# Altium schematic sheet OPAMPSupply.SchDoc
size A
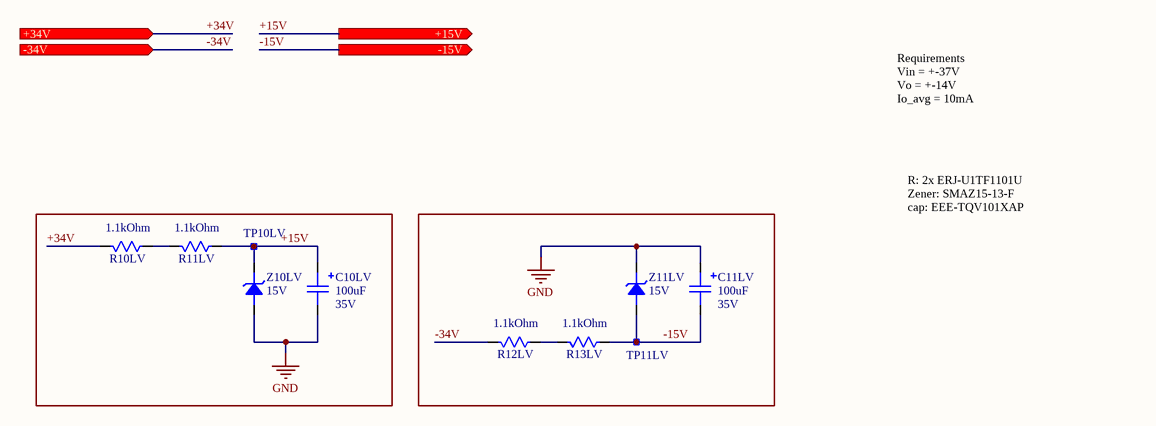
[diagram p0: OPAMPSupply.SchDoc]

## Parts
C10LV  Capacitance: 100uF  Voltage Rating: 35V  [CAPAE7866X80M-PANASONIC-TQ-A]  (hidden comment: EEE-TQV101XAP)
C11LV  Capacitance: 100uF  Voltage Rating: 35V  [CAPAE7866X80M-PANASONIC-TQ-A]  (hidden comment: EEE-TQV101XAP)
R10LV  Resistance: 1.1kOhm  [Chip2PinSM127P600-8N-PANASONIC-ERJU1T]  (hidden comment: ERJ-U1TF1101U)
R11LV  Resistance: 1.1kOhm  [Chip2PinSM127P600-8N-PANASONIC-ERJU1T]  (hidden comment: ERJ-U1TF1101U)
R12LV  Resistance: 1.1kOhm  [Chip2PinSM127P600-8N-PANASONIC-ERJU1T]  (hidden comment: ERJ-U1TF1101U)
R13LV  Resistance: 1.1kOhm  [Chip2PinSM127P600-8N-PANASONIC-ERJU1T]  (hidden comment: ERJ-U1TF1101U)
TP10LV  TP_0.75mm  [Pad_0.75mm]  (value not drawn)  (no BOM)
TP11LV  TP_0.75mm  [Pad_0.75mm]  (value not drawn)  (no BOM)
Z10LV  Zener Voltage: 15V  [DIODESINC-SMA]  (hidden comment: SMAZ15-13-F)
Z11LV  Zener Voltage: 15V  [DIODESINC-SMA]  (hidden comment: SMAZ15-13-F)

## Ports
+15V (out), +34V (in), -15V (out), -34V (in)

## Nets
GND: C10LV.2 C11LV.1 Z10LV.A Z11LV.K
+15V: C10LV.1 R11LV.2 TP10LV.?1 Z10LV.K ; port +15V
+34V: R10LV.1 ; port +34V
-15V: C11LV.2 R13LV.2 TP11LV.?1 Z11LV.A ; port -15V
-34V: R12LV.1 ; port -34V
NetR10LV_2: R10LV.2 R11LV.1
NetR12LV_2: R12LV.2 R13LV.1

## Notes on the sheet
- Requirements
  Vin = +-37V
  Vo = +-14V
  Io_avg = 10mA
- R: 2x ERJ-U1TF1101U
  Zener: SMAZ15-13-F
  cap: EEE-TQV101XAP

## Library data of the parts
C10LV C11LV = EEE-TQV101XAP: Cap Aluminum 100uF 35V 20% (6.3 X 7.7mm) SMD 0.0003 Ohm 197mA 2000 hr 125°C T/R; Manufacturer: Panasonic; ESR (Equivalent Series Resistance): 300mR; Life (Hours): 2000Hour; Lead Diameter: 0.65mm; Supplier 1: RSComponents; Manufacturer Part Number: EEE-TQV101XAP; RoHS: Yes; Category: Aluminum Electrolytic Capacitors; Stock 1: 10800; Pricing 1: 5=1.00000, 50=0.75600, 250=0.54600, 500=0.36400, 900=0.35000 (EUR); Mount: Surface Mount; Case/Package: Radial; Number of Pins: 8; Min Operating Temperature: -40°C; Max Operating Temperature: 125°C; Tolerance: 20%; Packaging: Tape and Reel; Package Quantity: 900; Ripple Current: 197mA; Voltage Rating (DC): 35V; Termination: SMD/SMT; Series: TQ; Ripple Current (AC): 197mA; Voltage: 35V; Construction: Cylindrical; Diameter: 6.3mm; Length: 7.7mm; Height: 7.7mm; Height - Seated (Max): 0.315inch; Lead Pitch: 1.8mm; RoHS Compliant: Yes; REACH SVHC: No SVHC; Lead Free: Lead Free; ComponentLink1URL: https://datasheet.ciiva.com/23859/aba0000ce139-23859013.pdf?src-supplier=Newark; ComponentLink1Description: https://datasheet.ciiva.com/23859/aba0000ce139-23859013.pdf?src-supplier=Newark; ComponentLink2URL: https://datasheet.ciiva.com/30502/0900766b81183640-30502676.pdf?src-supplier=RSComponents; ComponentLink2Description: https://datasheet.ciiva.com/30502/0900766b81183640-30502676.pdf?src-supplier=RSComponents; ComponentLink3URL: https://datasheet.ciiva.com/30198/aba0000ce139-30198276.pdf?src-supplier=Onlinecomponents.com; ComponentLink3Description: https://datasheet.ciiva.com/30198/aba0000ce139-30198276.pdf?src-supplier=Onlinecomponents.com; ComponentLink4URL: https://datasheet.ciiva.com/14497/1679509-14497981.pdf?src-supplier=Farnell; ComponentLink4Description: https://datasheet.ciiva.com/14497/1679509-14497981.pdf?src-supplier=Farnell; ComponentLink5URL: https://datasheet.ciiva.com/22683/1679509-22683999.pdf?src-supplier=Element14; ComponentLink5Description: https://datasheet.ciiva.com/22683/1679509-22683999.pdf?src-supplier=Element14; ComponentLink6URL: https://datasheet.ciiva.com/15934/aba0000ce139-15934059.pdf?src-supplier=Onlinecomponents.com; ComponentLink6Description: https://datasheet.ciiva.com/15934/aba0000ce139-15934059.pdf?src-supplier=Onlinecomponents.com
R10LV R11LV R12LV R13LV = ERJ-U1TF1101U: Power: 1W; Size: 2512
TP10LV TP11LV = TP_0.75mm: Pad testpoint with 0.75mm Diameter
Z10LV Z11LV = SMAZ15-13-F: Vz=15V 14.25V~15.75V Izt=50mA P=1W; Manufacturer: Diodes; Max Reverse Leakage Current: 1uA; Element Configuration: Single; Tolerance: 5%; Forward Voltage: 1.2V; Max Power Dissipation: 1W; Impedance: 10R; Test Current: 50mA; Supplier 1: Farnell; Manufacturer Part Number: SMAZ15-13-F; RoHS: Yes; Category: Zener Diodes; Stock 1: 7565; Pricing 1: 5=0.47100, 50=0.29300, 250=0.20100, 1000=0.15400 (EUR); Mount: Surface Mount; Case/Package: SMA; Number of Pins: 2; Weight: 0.002258oz; Min Operating Temperature: -65°C; Max Operating Temperature: 150°C; Packaging: Tape and Reel; Package Quantity: 5000; Voltage Tolerance: 5%; Zener Current: 1uA; Max Reverse Current: 1uA; Power Dissipation: 1W; Working Voltage: 15V; Termination: SMD/SMT; Power Rating: 1W; Voltage Rating (DC): 15V; Series: -; Length: 4.6mm; Width: 2.92mm; Height: 2.09mm; Radiation Hardening: No; Lead Free: Lead Free; RoHS Compliant: Yes; ComponentLink1URL: https://datasheet.ciiva.com/15142/getdatasheetpartid-93529-15142590.pdf?src-supplier=Verical; ComponentLink1Description: https://datasheet.ciiva.com/15142/getdatasheetpartid-93529-15142590.pdf?src-supplier=Verical; ComponentLink2URL: https://datasheet.ciiva.com/4734/ds18015-38228-4734232.pdf?src-supplier=Mouser; ComponentLink2Description: https://datasheet.ciiva.com/4734/ds18015-38228-4734232.pdf?src-supplier=Mouser; ComponentLink3URL: https://datasheet.ciiva.com/893/ds18015-893402.pdf?src-supplier=Digi-Key; ComponentLink3Description: https://datasheet.ciiva.com/893/ds18015-893402.pdf?src-supplier=Digi-Key; ComponentLink4URL: https://datasheet.ciiva.com/893/ds18015-893401.pdf?src-supplier=Digi-Key; ComponentLink4Description: https://datasheet.ciiva.com/893/ds18015-893401.pdf?src-supplier=Digi-Key